# EAGLE schematic BareBones Arduino full size (EAGLE 8.6.3)
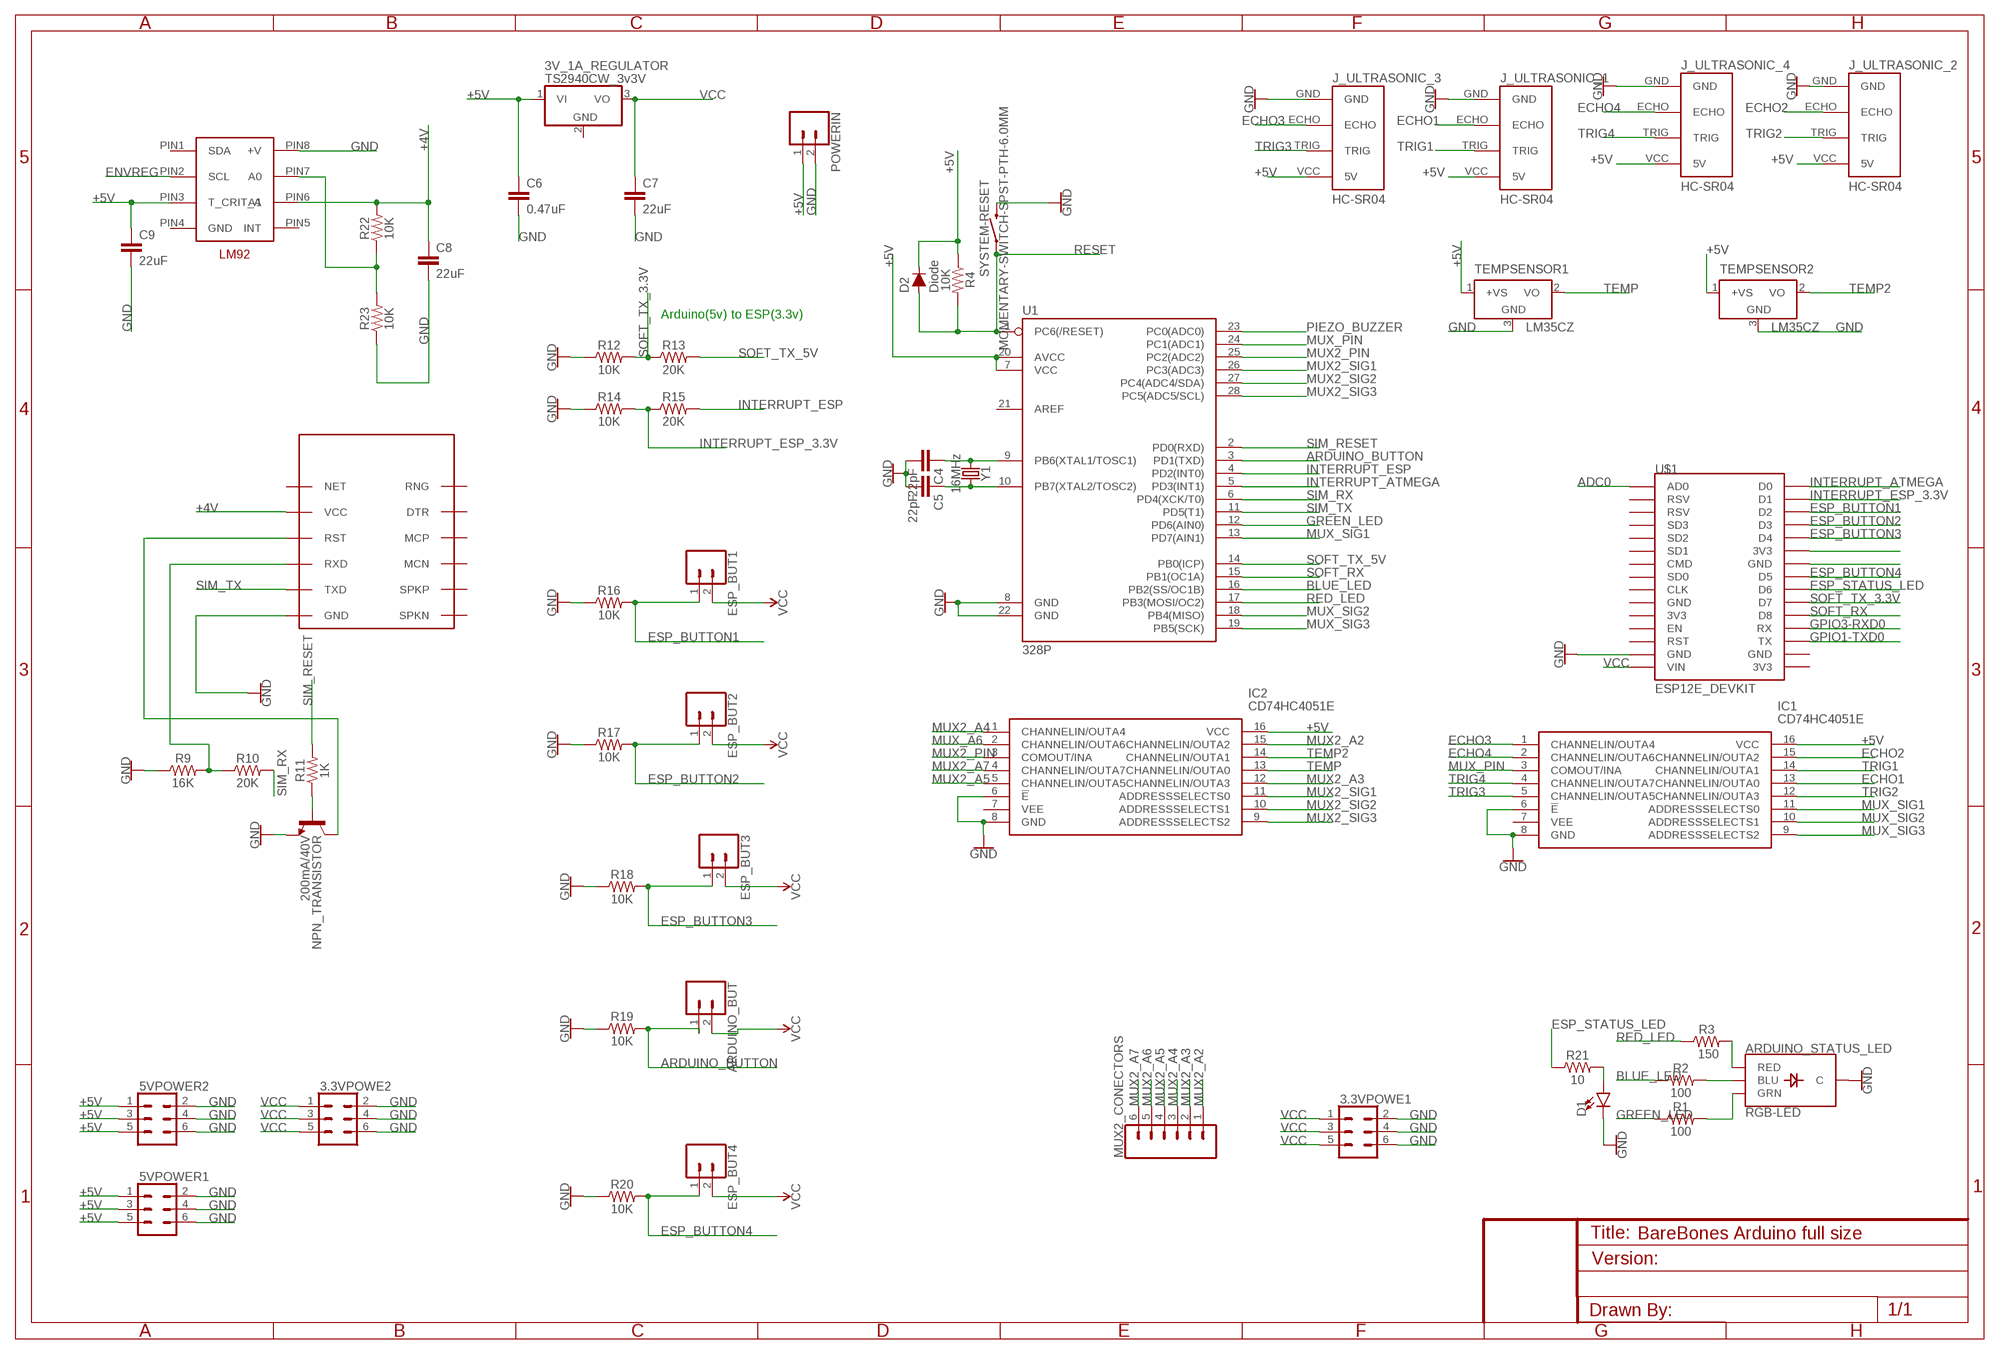
[diagram p0: schematic, sheet 1]

## Parts
3.3VPOWE1  CONN_03X2FEMALE  [2X3]
3.3VPOWE2  CONN_03X2FEMALE  [2X3]
3V_1A_REGULATOR  TS2940CW_3v3V  MCP1703DB  [SOT223]
5VPOWER1  CONN_03X2FEMALE  [2X3]
5VPOWER2  CONN_03X2FEMALE  [2X3]
ARDUINO_BUT  CONN_02  [1X02]
ARDUINO_STATUS_LED  RGB-LED  LED-RGB-CCDIFFUSE  [LED-RGB-THRU]
C4  22pF  22PF-PTH-2.54MM-200V-5%  [CAP-PTH-2.54]
C5  22pF  22PF-PTH-2.54MM-200V-5%  [CAP-PTH-2.54]
C6  0.47uF  0.1UF-KIT-EZ-50V-20%  [CAP-PTH-SMALL-KIT]
C7  22uF  0.1UF-KIT-EZ-50V-20%  [CAP-PTH-SMALL-KIT]
C8  22uF  0.1UF-KIT-EZ-50V-20%  [CAP-PTH-SMALL-KIT]
C9  22uF  0.1UF-KIT-EZ-50V-20%  [CAP-PTH-SMALL-KIT]
D1  LED5MM  [LED_5MM]
D2  Diode  DIODE-1N4148  [DIODE-1N4148]
ESP_BUT1  CONN_02  [1X02]
ESP_BUT2  CONN_02  [1X02]
ESP_BUT3  CONN_02  [1X02]
ESP_BUT4  CONN_02  [1X02]
IC1  CD74HC4051E  [DIP794W53P254L1930H508Q16N]
IC2  CD74HC4051E  [DIP794W53P254L1930H508Q16N]
J_ULTRASONIC_1  HC-SR04  [HC-SR04_FOOTPRINT]
J_ULTRASONIC_2  HC-SR04  [HC-SR04_FOOTPRINT]
J_ULTRASONIC_3  HC-SR04  [HC-SR04_FOOTPRINT]
J_ULTRASONIC_4  HC-SR04  [HC-SR04_FOOTPRINT]
MUX2_CONECTORS  CONN_06SILK_FEMALE_PTH  [1X06]
NPN_TRANSISTOR  200mA/40V  TRANS_NPN-2N3904  [TO-92]
POWERIN  CONN_025MM  [SCREWTERMINAL-5MM-2]
R1  100  100OHM-HORIZ-1/4W-1%  [AXIAL-0.3]
R2  100  100OHM-HORIZ-1/4W-1%  [AXIAL-0.3]
R3  150  RESISTORAXIAL-0.3  [AXIAL-0.3]
R4  10K  100OHM-HORIZ-1/4W-1%  [AXIAL-0.3]
R9  16K  100OHM-HORIZ-1/4W-1%  [AXIAL-0.3]
R10  20K  100OHM-HORIZ-1/4W-1%  [AXIAL-0.3]
R11  1K  100OHM-HORIZ-1/4W-1%  [AXIAL-0.3]
R12  10K  100OHM-HORIZ-1/4W-1%  [AXIAL-0.3]
R13  20K  100OHM-HORIZ-1/4W-1%  [AXIAL-0.3]
R14  10K  100OHM-HORIZ-1/4W-1%  [AXIAL-0.3]
R15  20K  100OHM-HORIZ-1/4W-1%  [AXIAL-0.3]
R16  10K  100OHM-HORIZ-1/4W-1%  [AXIAL-0.3]
R17  10K  100OHM-HORIZ-1/4W-1%  [AXIAL-0.3]
R18  10K  100OHM-HORIZ-1/4W-1%  [AXIAL-0.3]
R19  10K  100OHM-HORIZ-1/4W-1%  [AXIAL-0.3]
R20  10K  100OHM-HORIZ-1/4W-1%  [AXIAL-0.3]
R21  10  RESISTORAXIAL-0.3  [AXIAL-0.3]
R22  10K  100OHM-HORIZ-1/4W-1%  [AXIAL-0.3]
R23  10K  100OHM-HORIZ-1/4W-1%  [AXIAL-0.3]
SYSTEM-RESET  MOMENTARY-SWITCH-SPST-PTH-6.0MM  [TACTILE_SWITCH_PTH_6.0MM]
TEMPSENSOR1  LM35CZ  [TO92]
TEMPSENSOR2  LM35CZ  [TO92]
U1  328P  ATMEGA328P_PDIP  [DIP28]
U$1  ESP12E_DEVKIT  [ESP12E_DEVKIT]
U$4  SIM800L  [SIM-CORE]
VREG  LM92  [SOP-8]
Y1  16MHz  CRYSTAL-16MHZPTH-HC49US  [HC49US]

## Nets
+4V: C8.1 R22.P$2 U$4.VCC VREG.PIN6(A1)
+5V: 3V_1A_REGULATOR.1(VI) 5VPOWER1.1 5VPOWER1.3 5VPOWER1.5 5VPOWER2.1 5VPOWER2.3 5VPOWER2.5 C6.1 C9.1 D2.C IC1.16(VCC) IC2.16(VCC) J_ULTRASONIC_1.VCC(5V) J_ULTRASONIC_2.VCC(5V) J_ULTRASONIC_3.VCC(5V) J_ULTRASONIC_4.VCC(5V) POWERIN.1 R4.P$1 TEMPSENSOR1.1(+VS) TEMPSENSOR2.1(+VS) U1.7(VCC) U1.20(AVCC) VREG.PIN3(T_CRIT_A)
ADC0: U$1.AD0
ARDUINO_BUTTON: ARDUINO_BUT.1 R19.P$2 U1.3(PD1(TXD))
BLUE_LED: R2.P$1 U1.16(PB2(SS/OC1B))
ECHO1: IC1.13(CHANNELIN/OUTA0) J_ULTRASONIC_1.ECHO
ECHO2: IC1.15(CHANNELIN/OUTA2) J_ULTRASONIC_2.ECHO
ECHO3: IC1.1(CHANNELIN/OUTA4) J_ULTRASONIC_3.ECHO
ECHO4: IC1.2(CHANNELIN/OUTA6) J_ULTRASONIC_4.ECHO
ENVREG: VREG.PIN2(SCL)
ESP_BUTTON1: ESP_BUT1.1 R16.P$2 U$1.D2
ESP_BUTTON2: ESP_BUT2.1 R17.P$2 U$1.D3
ESP_BUTTON3: ESP_BUT3.1 R18.P$2 U$1.D4
ESP_BUTTON4: ESP_BUT4.1 R20.P$2 U$1.D5
ESP_STATUS_LED: R21.P$1 U$1.D6
GND: 3.3VPOWE1.2 3.3VPOWE1.4 3.3VPOWE1.6 3.3VPOWE2.2 3.3VPOWE2.4 3.3VPOWE2.6 5VPOWER1.2 5VPOWER1.4 5VPOWER1.6 5VPOWER2.2 5VPOWER2.4 5VPOWER2.6 ARDUINO_STATUS_LED.2(C) C4.2 C5.2 C6.2 C7.2 C8.2 C9.2 D1.K(C) IC1.6(!E) IC1.8(GND) IC2.6(!E) IC2.8(GND) J_ULTRASONIC_1.GND J_ULTRASONIC_2.GND J_ULTRASONIC_3.GND J_ULTRASONIC_4.GND NPN_TRANSISTOR.1(E) POWERIN.2 R9.P$1 R12.P$1 R14.P$1 R16.P$1 R17.P$1 R18.P$1 R19.P$1 R20.P$1 R23.P$1 SYSTEM-RESET.3 TEMPSENSOR1.3(GND) TEMPSENSOR2.3(GND) U1.8(GND) U1.22(GND) U$1.GND@1(GND) U$4.GND VREG.PIN8(+V)
GPIO1-TXD0: U$1.TX
GPIO3-RXD0: U$1.RX
GREEN_LED: R1.P$1 U1.12(PD6(AIN0))
INTERRUPT_ATMEGA: U1.5(PD3(INT1)) U$1.D0
INTERRUPT_ESP: R15.P$2 U1.4(PD2(INT0))
INTERRUPT_ESP_3.3V: R14.P$2 R15.P$1 U$1.D1
MUX2_A2: IC2.15(CHANNELIN/OUTA2) MUX2_CONECTORS.1
MUX2_A3: IC2.12(CHANNELIN/OUTA3) MUX2_CONECTORS.2
MUX2_A4: IC2.1(CHANNELIN/OUTA4) MUX2_CONECTORS.3
MUX2_A5: IC2.5(CHANNELIN/OUTA5) MUX2_CONECTORS.4
MUX2_A6: MUX2_CONECTORS.5
MUX2_A7: IC2.4(CHANNELIN/OUTA7) MUX2_CONECTORS.6
MUX2_PIN: IC2.3(COMOUT/INA) U1.25(PC2(ADC2))
MUX2_SIG1: IC2.11(ADDRESSSELECTS0) U1.26(PC3(ADC3))
MUX2_SIG2: IC2.10(ADDRESSSELECTS1) U1.27(PC4(ADC4/SDA))
MUX2_SIG3: IC2.9(ADDRESSSELECTS2) U1.28(PC5(ADC5/SCL))
MUX_A6: IC2.2(CHANNELIN/OUTA6)
MUX_PIN: IC1.3(COMOUT/INA) U1.24(PC1(ADC1))
MUX_SIG1: IC1.11(ADDRESSSELECTS0) U1.13(PD7(AIN1))
MUX_SIG2: IC1.10(ADDRESSSELECTS1) U1.18(PB4(MISO))
MUX_SIG3: IC1.9(ADDRESSSELECTS2) U1.19(PB5(SCK))
N$1: C5.1 U1.10(PB7(XTAL2/TOSC2)) Y1.2
N$2: ARDUINO_STATUS_LED.1(RED) R3.P$2
N$3: ARDUINO_STATUS_LED.4(BLU) R2.P$2
N$4: ARDUINO_STATUS_LED.3(GRN) R1.P$2
N$8: C4.1 U1.9(PB6(XTAL1/TOSC1)) Y1.1
N$11: R9.P$2 R10.P$1 U$4.RXD
N$12: NPN_TRANSISTOR.3(C) U$4.RST
N$13: D1.A R21.P$2
N$16: R22.P$1 R23.P$2 VREG.PIN7(A0)
N$19: U$1.3V3@1(3V3)
N$20: NPN_TRANSISTOR.2(B) R11.P$1
N$22: U$1.GND@2(GND)
PIEZO_BUZZER: U1.23(PC0(ADC0))
RED_LED: R3.P$1 U1.17(PB3(MOSI/OC2))
RESET: D2.A R4.P$2 SYSTEM-RESET.1 U1.1(PC6(/RESET))
SIM_RESET: R11.P$2 U1.2(PD0(RXD))
SIM_RX: R10.P$2 U1.6(PD4(XCK/T0))
SIM_TX: U1.11(PD5(T1)) U$4.TXD
SOFT_RX: U1.15(PB1(OC1A)) U$1.D8
SOFT_TX_3.3V: R12.P$2 R13.P$1 U$1.D7
SOFT_TX_5V: R13.P$2 U1.14(PB0(ICP))
TEMP: IC2.13(CHANNELIN/OUTA0) TEMPSENSOR1.2(VO)
TEMP2: IC2.14(CHANNELIN/OUTA1) TEMPSENSOR2.2(VO)
TRIG1: IC1.14(CHANNELIN/OUTA1) J_ULTRASONIC_1.TRIG
TRIG2: IC1.12(CHANNELIN/OUTA3) J_ULTRASONIC_2.TRIG
TRIG3: IC1.5(CHANNELIN/OUTA5) J_ULTRASONIC_3.TRIG
TRIG4: IC1.4(CHANNELIN/OUTA7) J_ULTRASONIC_4.TRIG
VCC: 3.3VPOWE1.1 3.3VPOWE1.3 3.3VPOWE1.5 3.3VPOWE2.1 3.3VPOWE2.3 3.3VPOWE2.5 3V_1A_REGULATOR.3(VO) ARDUINO_BUT.2 C7.1 ESP_BUT1.2 ESP_BUT2.2 ESP_BUT3.2 ESP_BUT4.2 U$1.VIN
Unconnected: 3V_1A_REGULATOR.2(GND) IC1.7(VEE) IC2.7(VEE) U1.21(AREF) U$1.3V3@0(3V3) U$1.3V3@2(3V3) U$1.CLK U$1.CMD U$1.EN U$1.GND@0(GND) U$1.GND@3(GND) U$1.RST U$1.RSV@0(RSV) U$1.RSV@1(RSV) U$1.SD0 U$1.SD1 U$1.SD2 U$1.SD3 U$4.DTR U$4.MCN U$4.MCP U$4.NET U$4.RNG U$4.SPKN U$4.SPKP VREG.PIN1(SDA) VREG.PIN4(GND) VREG.PIN5(INT)

## Notes on the sheet
- Arduino(5v) to ESP(3.3v)

## Library data of the parts
3.3VPOWE1 3.3VPOWE2 5VPOWER1 5VPOWER2 = SparkFun-Connectors:CONN_03X2: Multi connection point. Often used as Generic Header-pin footprint for 0.1 inch spaced/style header connections You can populate with any combo of single row headers, but if you'd like an exact match, check these: Header - 2x3 (Male, 0.1") <https://www.sparkfun.com/products/12807> (PRT-12807) Header - 2x3 (Female, 0.1") <https://www.sparkfun.com/products/13010> (PRT-13010) 2x3 Pin Shrouded Header <https://www.sparkfun.com/products/10877> (PRT-10877) On any of the 0.1 inch spaced packages, you can populate with these: Break Away Headers - Straight <https://www.sparkfun.com/products/116> (PRT-00116) Break Away Male Headers - Right Angle <https://www.sparkfun.com/products/553> (PRT-00553) Female Headers <https://www.sparkfun.com/products/115> (PRT-00115) Break Away Headers - Machine Pin <https://www.sparkfun.com/products/117> (PRT-00117) Break Away Female Headers - Swiss Machine Pin <https://www.sparkfun.com/products/743> (PRT-00743) Special note: the shrouded connector mates well with our 3x2 ribbon cables: Ribbon Crimp Connector - 6-pin (2x3, Female) <https://www.sparkfun.com/products/10651> (PRT-10651) Ribbon Cable - 6 wire (15ft) <https://www.sparkfun.com/products/10646> (PRT-10646); PROD_ID: CONN-11566; VALUE: FEMALE 2x3
3V_1A_REGULATOR = linear:MCP1703: 250 mA, 16V, Low Quiescent Current LDO Regulator Source: http://ww1.microchip.com/downloads/en/DeviceDoc/22049b.pdf
ARDUINO_BUT ESP_BUT1-ESP_BUT4 = SparkFun-Connectors:CONN_02: Multi connection point. Often used as Generic Header-pin footprint for 0.1 inch spaced/style header connections On any of the 0.1 inch spaced packages, you can populate with these: Break Away Headers - Straight <https://www.sparkfun.com/products/116> (PRT-00116) Break Away Male Headers - Right Angle <https://www.sparkfun.com/products/553> (PRT-00553) Female Headers <https://www.sparkfun.com/products/115> (PRT-00115) Break Away Headers - Machine Pin <https://www.sparkfun.com/products/117> (PRT-00117) Break Away Female Headers - Swiss Machine Pin <https://www.sparkfun.com/products/743> (PRT-00743) For SCREWTERMINALS and SPRING TERMINALS visit here: Screw Terimnals on SparkFun.com <https://www.sparkfun.com/search/results?term=Screw+Terminals> (5mm/3.5mm/2.54mm spacing) This device is also useful as a general connection point to wire up your design to another part of your project. Our various solder wires solder well into these plated through hole pads. Hook-Up Wire - Assortment (Stranded, 22 AWG) <https://www.sparkfun.com/products/11375> (PRT-11375) Hook-Up Wire - Assortment (Solid Core, 22 AWG) <https://www.sparkfun.com/products/11367> (PRT-11367) View the entire wire category on our website here <https://www.sparkfun.com/categories/141> Special notes: Molex polarized connector foot print use with: PRT-08233 with associated crimp pins and housings. 2.54_SCREWTERM for use with PRT-10571. 3.5mm Screw Terminal footprints for PRT-08084 5mm Screw Terminal footprints for use with PRT-08432
ARDUINO_STATUS_LED = SparkFun-LED:LED-RGB-CC: LED-RGB Common Cathode Packages: LED RGB-THRU LED_PIRANHA_5MM SparkFun Products: RGB Diffused Common Cathode- Diffuse <[https://www.sparkfun.com/products/9264]> RGB Diffused Common Cathode - Clear <[https://www.sparkfun.com/products/105]> LED-RGB 5mm Square (Piranha) <[https://www.sparkfun.com/products/11679]>; PROD_ID: DIO-09434; VALUE: DIFFUSE
C4 C5 = SparkFun-Capacitors:22PF: 22pF ceramic capacitors A capacitor is a passive two-terminal electrical component used to store electrical energy temporarily in an electric field.; PROD_ID: CAP-09128
C6-C9 = SparkFun-Capacitors:0.1UF: 0.1µF ceramic capacitors A capacitor is a passive two-terminal electrical component used to store electrical energy temporarily in an electric field.; PROD_ID: CAP-08370; VALUE: 0.1uF
D1 = SparkFun-LED:LED: LED (Generic) Standard schematic elements and footprints for 5mm, 3mm, 1206, and 0603 sized LEDs. Generic LEDs with no color specified.
D2 = SparkFun-DiscreteSemi:DIODE: Diode These are standard reverse protection diodes and small signal diodes. SparkFun Products: SparkFun SparkPunk Sound Kit <https://www.sparkfun.com/products/11177> SparkFun ESP8266 Thing <https://www.sparkfun.com/products/13231>; PROD_ID: DIO-08378; VALUE: 200mA/100V/1V
IC1 IC2 = CD74HC4051E:CD74HC4051E: CD74HC4051E, Multiplexer/Demultiplexer Single 8:1, 3 V, 5 V, 16-Pin, PDIP, 1 Source: Datasheet <http://www.ti.com/lit/ds/symlink/cd74hc4051.pdf>; DESCRIPTION: CD74HC4051E, Multiplexer/Demultiplexer Single 8:1, 3 V, 5 V, 16-Pin, PDIP, 1; HEIGHT: 5.08mm; MANUFACTURER_NAME: Texas Instruments; MANUFACTURER_PART_NUMBER: CD74HC4051E; RS_PART_NUMBER: 2508240054; SUPPLIER_NAME: RS
J_ULTRASONIC_1-J_ULTRASONIC_4 = UltraSonic Sensor:HC-SR04: Ultrasonic Sensor HC-SR04
MUX2_CONECTORS = SparkFun-Connectors:CONN_06: Multi connection point. Often used as Generic Header-pin footprint for 0.1 inch spaced/style header connections On any of the 0.1 inch spaced packages, you can populate with these: Break Away Headers - Straight <https://www.sparkfun.com/products/116> (PRT-00116) Break Away Male Headers - Right Angle <https://www.sparkfun.com/products/553> (PRT-00553) Female Headers <https://www.sparkfun.com/products/115> (PRT-00115) Break Away Headers - Machine Pin <https://www.sparkfun.com/products/117> (PRT-00117) Break Away Female Headers - Swiss Machine Pin <https://www.sparkfun.com/products/743> (PRT-00743) Arduino Stackable Header - 6 Pin <https://www.sparkfun.com/products/9280> (PRT-09280) For SCREWTERMINALS and SPRING TERMINALS visit here: Screw Terimnals on SparkFun.com <https://www.sparkfun.com/search/results?term=Screw+Terminals> (5mm/3.5mm/2.54mm spacing) This device is also useful as a general connection point to wire up your design to another part of your project. Our various solder wires solder well into these plated through hole pads. Hook-Up Wire - Assortment (Stranded, 22 AWG) <https://www.sparkfun.com/products/11375> (PRT-11375) Hook-Up Wire - Assortment (Solid Core, 22 AWG) <https://www.sparkfun.com/products/11367> (PRT-11367) View the entire wire category on our website here <https://www.sparkfun.com/categories/141>; PROD_ID: CONN-08437
NPN_TRANSISTOR = SparkFun-DiscreteSemi:TRANS_NPN: NPN transistor Current controlled devices typically used to amplify current or used as a switch. BC547 - COM-08928 <http://www.sparkfun.com/products/8928> (TO-92 45V 100mA) (1.Collector 2.Base 3.Emitter) 2N3904 - COM-00521 <http://www.sparkfun.com/products/521> (TO-92 40V 200mA) (1.Emitter 2.Base 3.Collector) P2N2222A - COM-12852 <http://www.sparkfun.com/products/12852> (TO-92 40V 600mA) (1.Collector 2.Base 3.Emitter); PROD_ID: TRANS-08447
POWERIN = SparkFun-Connectors:CONN_02: Multi connection point. Often used as Generic Header-pin footprint for 0.1 inch spaced/style header connections On any of the 0.1 inch spaced packages, you can populate with these: Break Away Headers - Straight <https://www.sparkfun.com/products/116> (PRT-00116) Break Away Male Headers - Right Angle <https://www.sparkfun.com/products/553> (PRT-00553) Female Headers <https://www.sparkfun.com/products/115> (PRT-00115) Break Away Headers - Machine Pin <https://www.sparkfun.com/products/117> (PRT-00117) Break Away Female Headers - Swiss Machine Pin <https://www.sparkfun.com/products/743> (PRT-00743) For SCREWTERMINALS and SPRING TERMINALS visit here: Screw Terimnals on SparkFun.com <https://www.sparkfun.com/search/results?term=Screw+Terminals> (5mm/3.5mm/2.54mm spacing) This device is also useful as a general connection point to wire up your design to another part of your project. Our various solder wires solder well into these plated through hole pads. Hook-Up Wire - Assortment (Stranded, 22 AWG) <https://www.sparkfun.com/products/11375> (PRT-11375) Hook-Up Wire - Assortment (Solid Core, 22 AWG) <https://www.sparkfun.com/products/11367> (PRT-11367) View the entire wire category on our website here <https://www.sparkfun.com/categories/141> Special notes: Molex polarized connector foot print use with: PRT-08233 with associated crimp pins and housings. 2.54_SCREWTERM for use with PRT-10571. 3.5mm Screw Terminal footprints for PRT-08084 5mm Screw Terminal footprints for use with PRT-08432; SF_SKU: PRT-08432
R1 R2 = SparkFun-Resistors:100OHM: 100Ω resistor A resistor is a passive two-terminal electrical component that implements electrical resistance as a circuit element. Resistors act to reduce current flow, and, at the same time, act to lower voltage levels within circuits. - Wikipedia; PROD_ID: RES-12181
R3 R21 = SparkFun-Resistors:RESISTOR: Generic Resistor Package
R4 R9-R20 R22 R23 = SparkFun-Resistors:100OHM: 100Ω resistor A resistor is a passive two-terminal electrical component that implements electrical resistance as a circuit element. Resistors act to reduce current flow, and, at the same time, act to lower voltage levels within circuits. - Wikipedia; PROD_ID: RES-12181; VALUE: 100
SYSTEM-RESET = SparkFun-Switches:MOMENTARY-SWITCH-SPST: Momentary Switch (Pushbutton) - SPST Normally-open (NO) SPST momentary switches (buttons, pushbuttons). Variants PTH-12MM - 12mm square, through-hole Momentary Pushbutton Switch - 12mm Square <https://www.sparkfun.com/products/9190> (COM-09190) PTH-6.0MM, PTH-6.0MM-KIT - 6.0mm square, through-hole Mini Pushbutton Switch <https://www.sparkfun.com/products/97> (COM-00097) KIT package intended for soldering kit's - only one side of pads' copper is exposed. PTH-RIGHT-ANGLE-KIT - Right-angle, through-hole Right Angle Tactile Button <https://www.sparkfun.com/products/10791> - Used on SparkFun BigTime Watch Kit <https://www.sparkfun.com/products/11734> SMD-12MM - 12mm square, surface-mount Tactile Button - SMD (12mm) <https://www.sparkfun.com/products/12993> (COM-12993) Used on SparkFun PicoBoard <https://www.sparkfun.com/products/11888> SMD-4.5MM - 4.5mm Square Trackball Switch Used on SparkFun Blackberry Trackballer Breakout <https://www.sparkfun.com/products/13169> SMD-4.6MMX2.8MM - 4.60mm x 2.80mm, surface mount Used on SparkFun SAMD21 Mini Breakout <https://www.sparkfun.com/products/13664> SMD-5.2MM, SMD-5.2-REDUNDANT - 5.2mm square, surface-mount Mini Pushbutton Switch - SMD <https://www.sparkfun.com/products/8720> (COM-08720) Used on Arduino Pro Mini <https://www.sparkfun.com/products/11114> REDUNDANT package connects both switch circuits together SMD-6.0X3.5MM - 6.0 x 3.5mm, surface mount Momentary Reset Switch SMD <https://www.sparkfun.com/products/8229> (COM-08229) SMD-6.2MM-TALL - 6.2mm square, surface mount Tactile Button - SMD (6mm) <https://www.sparkfun.com/products/12992> Used on SparkFun Digital Sandbox <https://www.sparkfun.com/products/12651> SMD-RIGHT-ANGLE - Right-angle, surface mount Used on SparkFun Block for Intel® Edison - Arduino <https://www.sparkfun.com/products/13036>; PROD_ID: SWCH-08441; SF_SKU: COM-00097
TEMPSENSOR1 TEMPSENSOR2 = lm35:LM35: Single-Supply Centigrade Temperature Sensor Vout = (10mV/°C x Temp °C) +5mmmV Source: http://www.national.com/ds/LM/LM35.pdf
U1 = SparkFun-IC-Microcontroller:ATMEGA328P_PDIP: Atmel 328P Through hole ATMEGA328P uC used in the Arduino 32kb flash, 1k EEPROM, 2k SRAM Datasheet <http://www.sparkfun.com/datasheets/Components/SMD/ATMega328.pdf> SparkFun Products Storefront component: AVR 28 Pin 20MHz 32K 6A/D - ATMega328P <https://www.sparkfun.com/products/9061> (COM-09061) SparkFun Simon Says - Through-Hole Soldering Kit <https://www.sparkfun.com/products/10547> (KIT-10547) SparkFun Learn to Solder - Simon Says <https://www.sparkfun.com/products/13708> (KIT-13708) SparkFun BigTime Watch Kit <https://www.sparkfun.com/products/11734> (KIT-11734) SparkFun ClockIt <https://www.sparkfun.com/products/10930> (KIT-10930) SparkFun Serial Enabled LCD Kit <https://www.sparkfun.com/products/10097> (LCD-10097) SparkFun Simon Tilts - Through Hole Soldering Kit <https://www.sparkfun.com/products/12634> (KIT-12634) SparkFun Frequency Counter Kit <https://www.sparkfun.com/products/10140> (KIT-10140) FabFM Radio Kit <https://www.sparkfun.com/products/11043> (KIT-11043) SparkFun Binary Blaster Kit <https://www.sparkfun.com/products/12037> (KIT-12037) SparkFun Metro-Gnome <https://www.sparkfun.com/products/9236> (KIT-09236) ATmega328 with Arduino Optiboot (Uno) <https://www.sparkfun.com/products/10524> (DEV-10524); PROD_ID: IC-09136
U$1 = nodeMCU:ESP12E_DEVKIT: ESP12E DEVKIT BOARD
U$4 = SIM800L2:SIM800L
VREG = smdfootprint:LM92; SPICEPREFIX: X
Y1 = SparkFun-Clocks:CRYSTAL-16MHZ: 16MHz Crystal Digikey Example <http://www.digikey.com/product-search/en?keywords=535-9122-1-ND> Frequency: 16MHz Frequency Stability: ±50ppm Frequency Tolerance: ±20ppm Load Capacitance: 18pF SparkFun Products: Pro Micro -5V/16MHz <https://www.sparkfun.com/products/12640> SparkFun Serial Enabled LCD Kit <https://www.sparkfun.com/products/10097>; PROD_ID: XTAL-08181; SF_ID: COM-00536